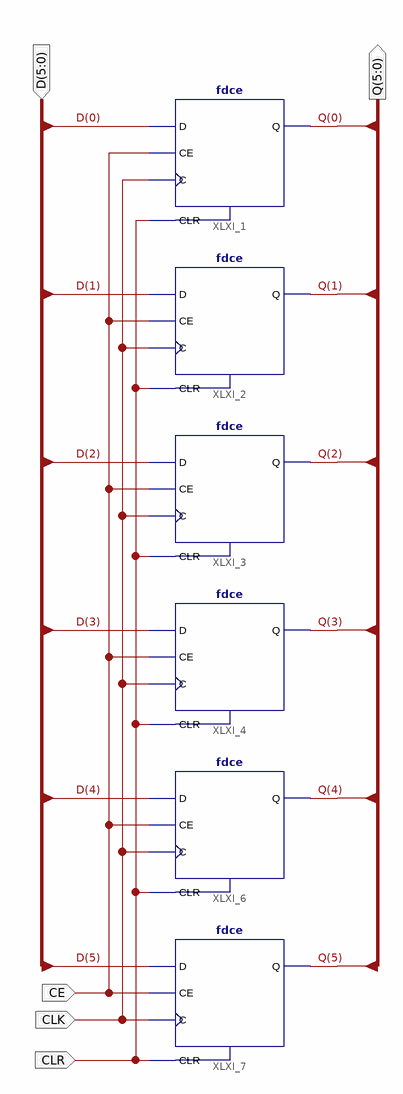
[diagram p0: schematic sheet 1]
// Xilinx ISE schematic fd6ce.sch (spartan6) as structural Verilog: 6 symbols, 5 ports
module fd6ce (
  input  CLR,
  input  CLK,
  input  CE,
  input  [5:0] D,
  output [5:0] Q
);

  fdce XLXI_1 (.C(CLK), .CE(CE), .CLR(CLR), .D(D[0]), .Q(Q[0]));
  fdce XLXI_2 (.C(CLK), .CE(CE), .CLR(CLR), .D(D[1]), .Q(Q[1]));
  fdce XLXI_3 (.C(CLK), .CE(CE), .CLR(CLR), .D(D[2]), .Q(Q[2]));
  fdce XLXI_4 (.C(CLK), .CE(CE), .CLR(CLR), .D(D[3]), .Q(Q[3]));
  fdce XLXI_6 (.C(CLK), .CE(CE), .CLR(CLR), .D(D[4]), .Q(Q[4]));
  fdce XLXI_7 (.C(CLK), .CE(CE), .CLR(CLR), .D(D[5]), .Q(Q[5]));
endmodule
